# Altium schematic sheet 200PinConnector.SchDoc
size Letter
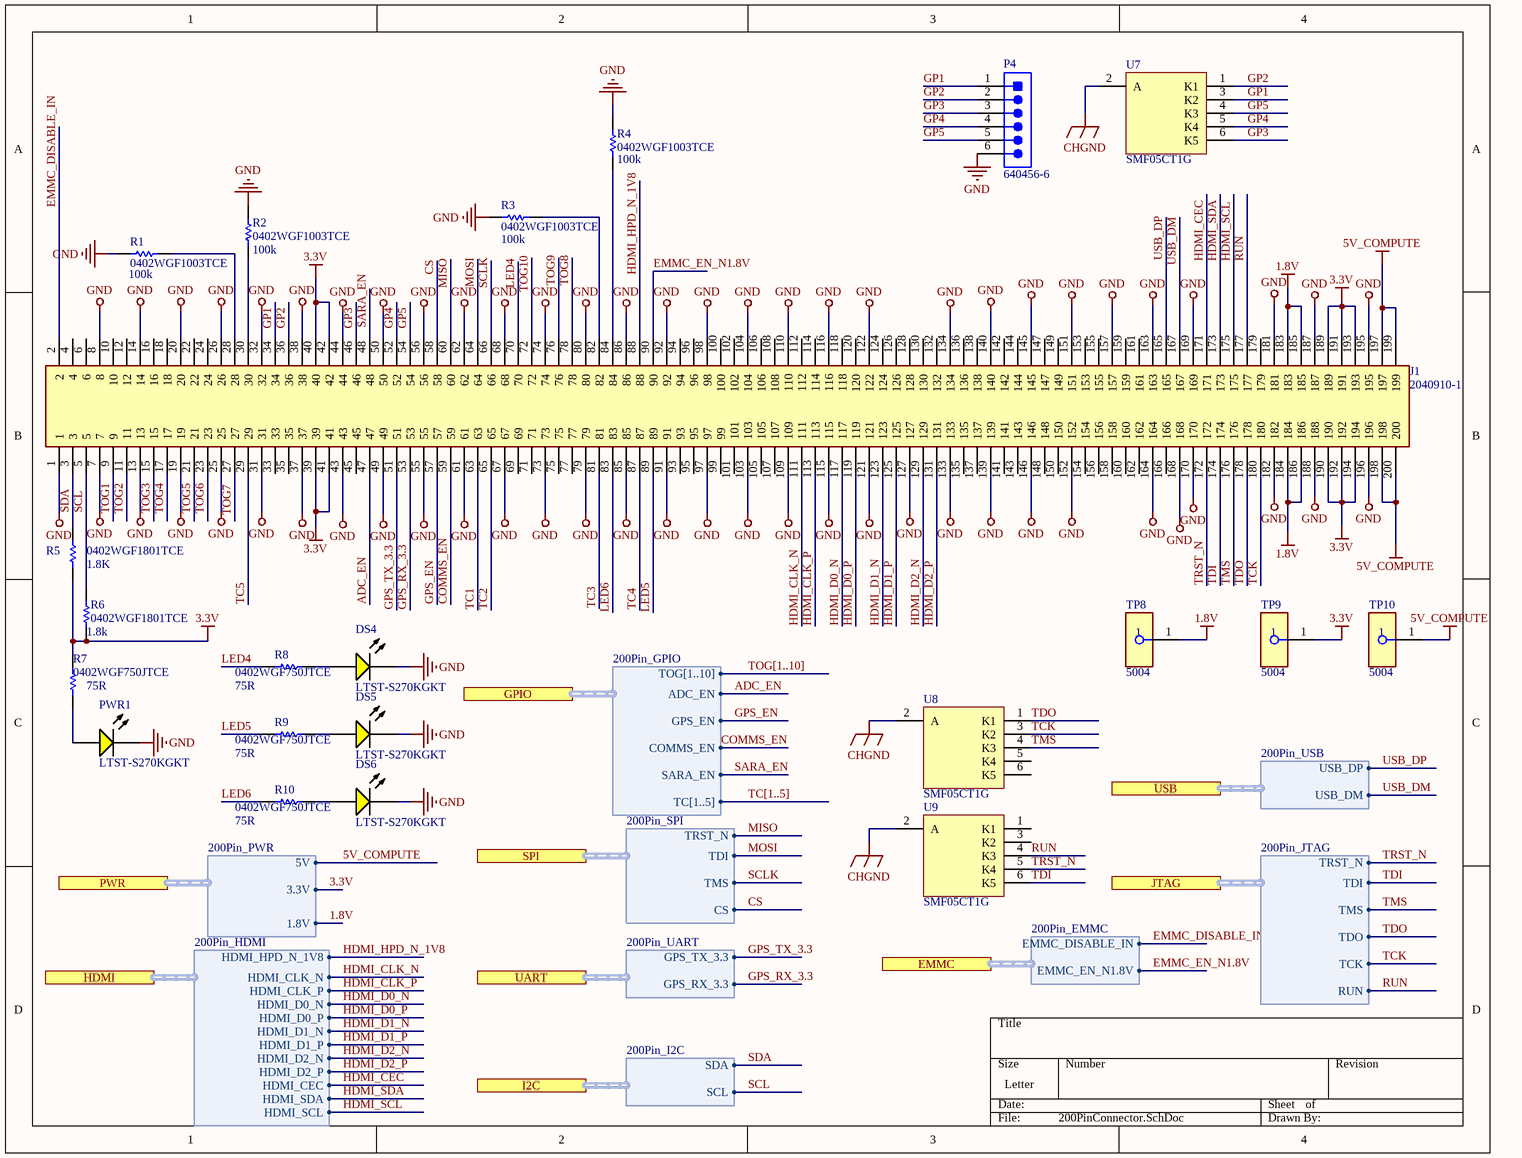
[diagram p0: 200PinConnector.SchDoc]

## Parts
DS4  LTST-S270KGKT  [AVAG-HSMX-C190_V]
DS5  LTST-S270KGKT  [AVAG-HSMX-C190_V]
DS6  LTST-S270KGKT  [AVAG-HSMX-C190_V]
J1  2040910-1  [20409101]
P4  640456-6  [TECO-640456-6_V]
PWR1  LTST-S270KGKT  [AVAG-HSMX-C190_V]
R1  0402WGF1003TCE  [0402]
R2  0402WGF1003TCE  [0402]
R3  0402WGF1003TCE  [0402]
R4  0402WGF1003TCE  [0402]
R5  0402WGF1801TCE  value 1.8K  [0402]
R6  0402WGF1801TCE  [0402]
R7  0402WGF750JTCE  [RESC1005X40X25ML05T10]
R8  0402WGF750JTCE  [RESC1005X40X25ML05T10]
R9  0402WGF750JTCE  [RESC1005X40X25ML05T10]
R10  0402WGF750JTCE  [RESC1005X40X25ML05T10]
TP8  5004  [FP-5004-MFG]
TP9  5004  [FP-5004-MFG]
TP10  5004  [FP-5004-MFG]
U7  SMF05CT1G  [ONSC-SC70-6-419B-02_W_V]
U8  SMF05CT1G  [ONSC-SC70-6-419B-02_W_V]
U9  SMF05CT1G  [ONSC-SC70-6-419B-02_W_V]

## Ports
EMMC (harness 200Pin_EMMC), GPIO (harness 200Pin_GPIO), HDMI (harness 200Pin_HDMI), I2C (harness 200Pin_I2C), JTAG (harness 200Pin_JTAG), PWR (harness 200Pin_PWR), SPI (harness 200Pin_SPI), UART (harness 200Pin_UART), USB (harness 200Pin_USB)

## Harnesses
200Pin_USB: USB_DP, USB_DM
200Pin_JTAG: TRST_N, TDI, TMS, TDO, TCK, RUN
200Pin_HDMI: HDMI_HPD_N_1V8, HDMI_CLK_N, HDMI_CLK_P, HDMI_D0_N, HDMI_D0_P, HDMI_D1_N, HDMI_D1_P, HDMI_D2_N, HDMI_D2_P, HDMI_CEC, HDMI_SDA, HDMI_SCL
200Pin_PWR: 5V, 3.3V, 1.8V
200Pin_I2C: SDA, SCL
200Pin_UART: GPS_TX_3.3, GPS_RX_3.3
200Pin_SPI: TRST_N, TDI, TMS, CS
200Pin_EMMC: EMMC_DISABLE_IN, EMMC_EN_N1.8V
200Pin_GPIO: TOG[1..10], ADC_EN, GPS_EN, COMMS_EN, SARA_EN, TC[1..5]

## Nets
1.8V: J1.183 J1.184 J1.185 J1.186 TP8.1 ; port PWR.1.8V
3.3V: J1.39 J1.40 J1.41 J1.42 J1.189 J1.190 J1.191 J1.192 J1.193 J1.194 R5.1 R6.1 R7.1 TP9.1 ; port PWR.3.3V
5V_COMPUTE: J1.197 J1.198 J1.199 J1.200 TP10.1 ; port PWR.5V
CHGND: U7.2(A) U8.2(A) U9.2(A)
GND: DS4.2(K) DS5.2(K) DS6.2(K) J1.1 J1.7 J1.8 J1.13 J1.14 J1.19 J1.20 J1.25 J1.26 J1.31 J1.32 J1.37 J1.38 J1.43 J1.44 J1.49 J1.50 J1.55 J1.56 J1.61 J1.62 J1.67 J1.68 J1.73 J1.74 J1.79 J1.80 J1.85 J1.86 J1.91 J1.92 J1.97 J1.98 J1.103 J1.104 J1.109 J1.110 J1.115 J1.116 J1.121 J1.122 J1.127 J1.133 J1.134 J1.139 J1.140 J1.145 J1.146 J1.151 J1.152 J1.157 J1.163 J1.164 J1.168 J1.169 J1.170 J1.181 J1.182 J1.187 J1.188 J1.195 J1.196 P4.6 PWR1.2(K) R1.2 R2.2 R3.2 R4.2
ADC_EN: J1.47 ; port GPIO.ADC_EN
COMMS_EN: J1.59 ; port GPIO.COMMS_EN
CS: J1.58 ; port SPI.CS
EMMC_DISABLE_IN: J1.2 ; port EMMC.EMMC_DISABLE_IN
EMMC_EN_N1.8V: J1.90 ; port EMMC.EMMC_EN_N1.8V
GP1: J1.34 P4.1 U7.3(K2)
GP2: J1.36 P4.2 U7.1(K1)
GP3: J1.46 P4.3 U7.6(K5)
GP4: J1.52 P4.4 U7.5(K4)
GP5: J1.54 P4.5 U7.4(K3)
GPS_EN: J1.57 ; port GPIO.GPS_EN
GPS_RX_3.3: J1.53 ; port UART.GPS_RX_3.3
GPS_TX_3.3: J1.51 ; port UART.GPS_TX_3.3
HDMI_CEC: J1.171 ; port HDMI.HDMI_CEC
HDMI_CLK_N: J1.111 ; port HDMI.HDMI_CLK_N
HDMI_CLK_P: J1.113 ; port HDMI.HDMI_CLK_P
HDMI_D0_N: J1.117 ; port HDMI.HDMI_D0_N
HDMI_D0_P: J1.119 ; port HDMI.HDMI_D0_P
HDMI_D1_N: J1.123 ; port HDMI.HDMI_D1_N
HDMI_D1_P: J1.125 ; port HDMI.HDMI_D1_P
HDMI_D2_N: J1.129 ; port HDMI.HDMI_D2_N
HDMI_D2_P: J1.131 ; port HDMI.HDMI_D2_P
HDMI_HPD_N_1V8: J1.88 ; port HDMI.HDMI_HPD_N_1V8
HDMI_SCL: J1.175 ; port HDMI.HDMI_SCL
HDMI_SDA: J1.173 ; port HDMI.HDMI_SDA
LED4: J1.70 R8.2
LED5: J1.89 R9.2
LED6: J1.83 R10.2
MISO: J1.60 ; port SPI.TRST_N
MOSI: J1.64 ; port SPI.TDI
RUN: J1.177 U9.4(K3) ; port JTAG.RUN
SARA_EN: J1.48 ; port GPIO.SARA_EN
SCL: J1.5 R6.2 ; port I2C.SCL
SCLK: J1.66 ; port SPI.TMS
SDA: J1.3 R5.2 ; port I2C.SDA
TC1: J1.63
TC2: J1.65
TC3: J1.81
TC4: J1.87
TC5: J1.29
TCK: J1.180 U8.3(K2) ; port JTAG.TCK
TDI: J1.174 U9.6(K5) ; port JTAG.TDI
TDO: J1.178 U8.1(K1) ; port JTAG.TDO
TMS: J1.176 U8.4(K3) ; port JTAG.TMS
TOG1: J1.9
TOG2: J1.11
TOG3: J1.15
TOG4: J1.17
TOG5: J1.21
TOG6: J1.23
TOG7: J1.27
TOG8: J1.78
TOG9: J1.76
TOG10: J1.72
TRST_N: J1.172 U9.5(K4) ; port JTAG.TRST_N
USB_DM: J1.167 ; port USB.USB_DM
USB_DP: J1.165 ; port USB.USB_DP
NetDS4_1: DS4.1(A) R8.1
NetDS5_1: DS5.1(A) R9.1
NetDS6_1: DS6.1(A) R10.1
NetJ1_28: J1.28 R1.1
NetJ1_30: J1.30 R2.1
NetJ1_82: J1.82 R3.1
NetJ1_84: J1.84 R4.1
NetPWR1_1: PWR1.1(A) R7.2

Not connected (* = marked no-connect by the designer): J1 4 6 10 12 16 18 22 24 33 35 45 69 71 75 77 93 94 95 96 99 100 101 102 105 106 107 108 112 114 118 120 124 126 128 130 132 135 136 137 138 141 142 143 144 147 148 149 150 153 154 155 156 158 159 160 161 162 166 179; U8 5(K4) 6(K5); U9 1(K1) 3(K2)

## Buses and harness runs
bus TC[1..5]
bus TOG[1..10]

## Notes on the sheet
- (near R4) 100k
- (near R1) 100k
- (near R2) 100k
- (near R3) 100k
- (near R6) 1.8k
- (near R7) 75R
- (near R8) 75R
- (near R9) 75R
- (near R10) 75R

## Library data of the parts
DS4-DS6 PWR1 = CMP-1744-00003-1: LED Uni-Color Yellow, 65 mW, 20 mA, -40 to 85 degC, 2-Pin SMD, RoHS, Tape and Reel; Tolerance: 1%; Voltage Rating: 50 V; Power Rating: 100 mW; Case\Package: 0603; Resistance: 390 Ohm; Min Operating Temperature: -55 degC; Length: 1.6 mm; ComponentLink3Description: Package Specification; Mount: Surface Mount; PackageReference: HSMX-C190; ComponentLink2Description: Datasheet; DatasheetVersion: Mar-12; Case Code (Metric): 1608; Pins: 2; Package Quantity: 5000; ComponentLink2URL: http://docs.avagotech.com/docs/AV02-0551EN; ComponentLink1Description: Manufacturer URL; RoHSCompliant: true; Packaging: Tape and Reel; PackageDescription: 2-Pin Surface Mount Device, Body 1.6 x 0.8 mm, Height 0.9 mm; REACH SVHC: No SVHC; ComponentLink3URL: http://www.fairchildsemi.com/dwg/MA/MA03D.pdf; Voltage Rating (DC): 50 V; Width: 0.8 mm; ComponentLink1URL: http://www.avagotech.com/; Max Operating Temperature: 155 degC; Case Code (Imperial): 0603; Height: 0.45 mm
J1 = 2040910-1: 200 Pin Connector; Manufacturer_Name: TE Connectivity; Datasheet Link: https://www.arrow.com/en/products/2040910-1/te-connectivity; Height: 15mm; Manufacturer_Part_Number: 2040910-1; Arrow Part Number: 2040910-1; Arrow Price/Stock: https://www.arrow.com/en/products/2040910-1/te-connectivity; Mouser Part Number: 571-2040910-1; Mouser Price/Stock: https://www.mouser.co.uk/ProductDetail/TE-Connectivity/2040910-1?qs=kAqyOuzYGe9tF8FZbDgYRA%3D%3D
P4 = CMP-2000-05661-1: Male Header, Pitch 2.54 mm, 1 x 6 Position, Height 10.03 mm, Tail Length 3.56 mm, -55 to 105 degC, Bulk; Manufacturer: TE Connectivity; Contact Centerline Spacing: 0.100 / in.; Number of Contacts: 6; Current, Rating: 5 / A; Agency Approvals: CSA,UL; Material, Contact: CopperAlloy; Mounting Hole Size: 0.04 / "; Brand/Series: MTA-100Series; Pin Spacing: 0.1 / "; Mount Angle: Vertical; Contact Termination Area Plating: Tin; Angle: Straight; Primary Type: InterconnectSystem; Standards: RoHSCompliant,ELVCompliant,UL94V-0; Temperature, Operating: -55to+105 / °C; Material, Housing: Polyester; Special Features: Pinstrip; Color, Housing: White; Connector Type: MTA-100; Voltage, Rating: 250 / V; Termination: Solder; Package Reference: 640456-6; Size, Post: 0.025 / in.; Color: White; Datasheet URL: https://datasheet.ciiva.com/25618/0900766b80eb7fdd-25618163.pdf; Manufacturer URL: http://www.te.com/; Mounting Type: PCMount; Length, Pin: 0.14 / "; Type: PCBPlug; Length, Overall: 0.6 / "; Mounting Technology: ThroughHole; Number of Rows: 1; Contact Shape: Square; Contact Mating Area Plating: Tin; Datasheet Version: Rev. W, 05/2005; Number of Positions: 6; Package Description: Male Header, Pitch 2.54 mm, 1 x 6 Position, Height 10.03 mm, Tail Length 3.56 mm; Contact Plating: Tin; Length, Terminal Post: 0.14 / in.; Flammability Rating: UL94V-0
R1-R4 = Res1: 100k 0402; Published: 8-Jun-2000; LatestRevisionDate: 17-Jul-2002; LatestRevisionNote: Re-released for DXP Platform.; PackageReference: AXIAL-0.3; Publisher: Altium Limited; PackageDescription: Axial Device, Thru-Hole; 2 Leads; 0.3 in Pin Spacing
  R1: Case Code (Imperial): 0402
R5 R6 = Res1: 1.8k 0402; Published: 8-Jun-2000; LatestRevisionDate: 17-Jul-2002; LatestRevisionNote: Re-released for DXP Platform.; PackageReference: AXIAL-0.3; Publisher: Altium Limited; PackageDescription: Axial Device, Thru-Hole; 2 Leads; 0.3 in Pin Spacing
R7-R10 = CMP-2002-07344-1: 75R 0402; Part Number: RC0402FR-07100RL; Manufacturer: Yageo / Phycomp
TP8-TP10 = CMP-2000-05575-2: PC TEST POINT MINIATURE YELLOW; Manufacturer: Keystone; Number Of Contacts: 1; Is Female: yes; Device Class L1: Connectors; Manufacturer Part Number: 5004; Digikey Description: PC TEST POINT MINIATURE YELLOW; ComponentLink2URL: https://www.keyelco.com/product-pdf.cfm?p=1313; Lead Free: Yes; ComponentLink2Description: Datasheet; Category: Conn; Height: 4.72mm; Octopart: https://octopart.com/5004-keystone-28591; Mouser Description: TEST POINT PC MINI .040"D YELLOW; Device Class L3: unset; Contact Material: Silver; Package: 5004; Automotive: No; Device Class L2: unset; RoHS: TRUE
U7-U9 = CMP-1061-00155-1: 5-Line Transient Voltage Suppressor Array, 6-Pin SC70, Pb-Free, Tape and Reel; Manufacturer: On Semiconductor; PPK Max (W): 100; Direction: Unidirectional; IR Max (uA): 5; PackageDescription: 6-Pin Small Outline Transistor, Body 2 x 1.25 mm, Pitch 0.65 mm; PackageReference: SC70-6-419B-02_W; ComponentLink2Description: Datasheet; Mounting Technology: Surface Mount; Packing: Tape and Reel; DatasheetVersion: Rev. 4; ComponentLink1Description: Manufacturer URL; ComponentLink2URL: http://www.onsemi.com/pub_link/Collateral/SMF05C-D.PDF; ComponentLink3Description: Package Specification; ComponentLink1URL: http://www.onsemi.com/; ComponentLink3URL: http://www.onsemi.com/pub_link/Collateral/SMF05C-D.PDF; PackageVersion: Rev. W; PartNumber: SMF05CT1G; RoHS: Pb-Free